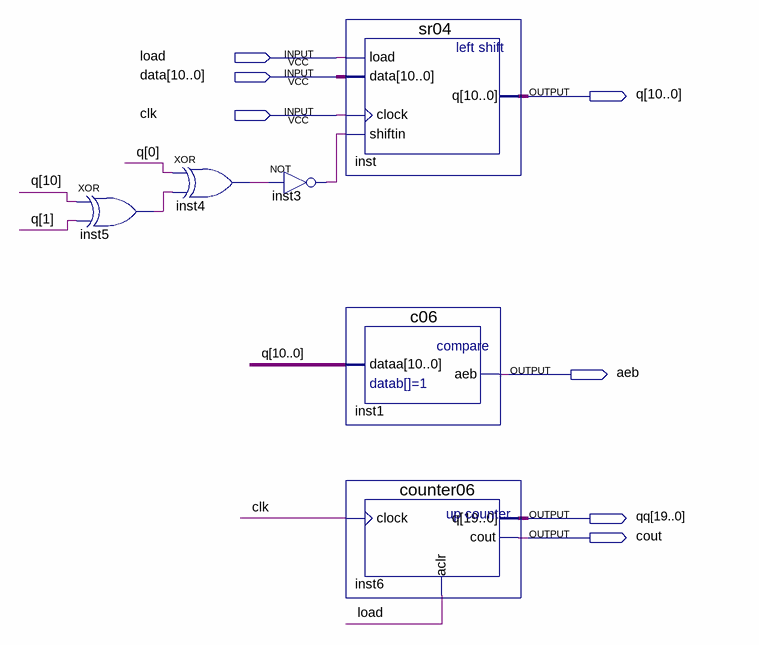
[diagram p0: schematic sheet]
// Quartus schematic b06.bdf as structural Verilog: 6 symbols, 7 pins
module b06 (
  input  load,
  input  [10:0] data,
  input  clk,
  output [10:0] q,
  output aeb,
  output [19:0] qq,
  output cout
);

  wire inst3_out, inst4_out, inst5_out;

  xor inst5 (inst5_out, q[10], q[1]);
  xor inst4 (inst4_out, q[0], inst5_out);
  not inst3 (inst3_out, inst4_out);
  sr04 inst (.clock(clk), .data(data), .load(load), .shiftin(inst3_out), .q(q));
  c06 inst1 (.dataa(q), .aeb(aeb));
  counter06 inst6 (.clock(clk), .aclr(load), .cout(cout), .q(qq));
endmodule
